# Altium schematic sheet Connectors.SchDoc: SmartCoin
size A4; Date: 22.06.2025; Author: Vamsi Krishna Sesham; Revision: A; SheetNumber: 3; SheetTotal: 5
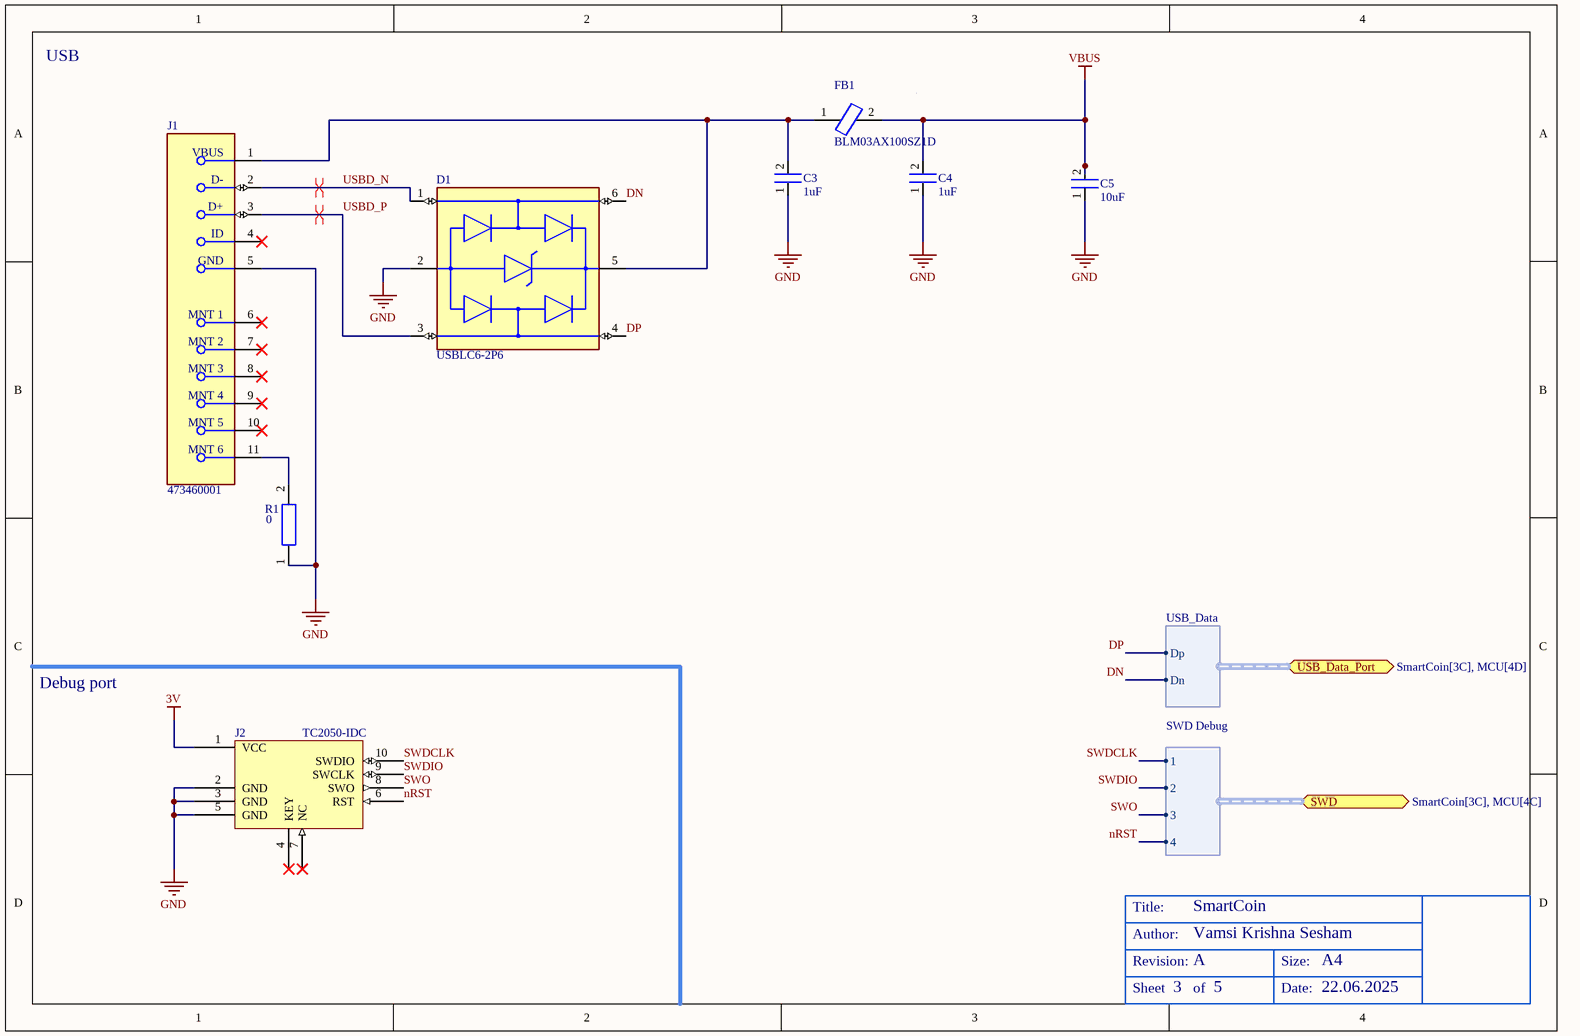
[diagram p0: Connectors.SchDoc]

## Parts
*  TitleBlock  (value not drawn)  (graphical)
C3  1uF  [Capacitor - 0201]
C4  1uF  [Capacitor - 0201]
C5  10uF  [Capacitor - 0402]
D1  USBLC6-2P6  [FP-SOT-666-MFG]
FB1  BLM03AX100SZ1D  [Ferrite Beat - 0201]
J1  473460001  [FP-473460001-MFG]
J2  TC2050-IDC  [TC2050-IDC]  (no BOM)
R1  0  [Resistor - 0402]

## Ports
SWD (bidir, harness SWD Debug, see SmartCoin[3C], MCU[4C]), USB_Data_Port (bidir, harness USB_Data, see SmartCoin[3C], MCU[4D])

## Harnesses
USB_Data: Dp, Dn
SWD Debug: 1, 2, 3, 4

## Nets
3V: J2.1(VCC)
GND: C3.1 C4.1 C5.1 D1.2(GND) J1.5(GND) J2.2(GND) J2.3(GND) J2.5(GND) R1.1
VBUS: C4.2 C5.2 FB1.2
DN: D1.6(I/O1) ; port USB_Data_Port.Dn
DP: D1.4(I/O2) ; port USB_Data_Port.Dp
nRST: J2.6(RST) ; port SWD.4
SWDCLK: J2.10(SWDIO) ; port SWD.1
SWDIO: J2.9(SWCLK) ; port SWD.2
SWO: J2.8(SWO) ; port SWD.3
USBD_N: D1.1(I/O1) J1.2(D-)
USBD_P: D1.3(I/O2) J1.3(D+)
NetC3_2: C3.2 D1.5(VBUS) FB1.1 J1.1(VBUS)
NetJ1_11: J1.11(MNT_6) R1.2

Not connected (* = marked no-connect by the designer): J1 4(ID)* 6(MNT_1)* 7(MNT_2)* 8(MNT_3)* 9(MNT_4)* 10(MNT_5)*; J2 4(KEY)* 7(NC)*

## Layout directives
differential pair: USBD_N, USBD_P

## Notes on the sheet
- USB
- Debug port
- (in symbol TitleBlock) Title:; Author:; Revision:; Size:; A4; Sheet; of; Date:

## Library data of the parts
C3 C4 = Capacitor - 0201
C5 = Capacitor - 0402
D1 = CMP-12225-000058-1: TVS DIODE 5.25V 17V SOT666; Min Breakdown Voltage: 6V; Power Line Protection: Yes; Element Configuration: Dual; Test Current: 1mA; Working Voltage: 5V; Number of Channels: 2; Max Reverse Leakage Current: 150nA; Direction: Unidirectional; Peak Pulse Current: 5A; Number of Elements: 1; Capacitance: 3.5pF; Max Breakdown Voltage: 6V; Height: 0.6mm; Depth: 1.3mm; Contact Plating: Tin; Reverse Breakdown Voltage: 6V; REACH SVHC: No SVHC; Operating Supply Voltage: 5V; Width: 1.3mm; Max Operating Temperature: 125°C; Reverse Standoff Voltage: 5V; ESD Protection: Yes; Package Quantity: 1; Termination: SMD/SMT; Length: 1.7mm; Leakage Current: 150nA; Number of Bidirectional Channels: 2; Case/Package: SOT-666; Min Operating Temperature: -40°C; Number of Pins: 6; Clamping Voltage: 17V; Breakdown Voltage: 6V; Lead Free: Lead Free; Radiation Hardening: No; Packaging: Tape and Reel; Mount: Surface Mount; Polarity: Unidirectional
FB1 = Ferrite Bead - 0201: Supplier 1: Digikey; Supplier Part Number 1: 445-MPZ1608S601ATD25CT-ND
J1 = CMP-2000-05246-2: CONN RCPT USB2.0 MICRO B SMD R/A; Manufacturer: Molex; Conn Orientation: Right Angle; Is Female: yes; Shielding: true; Pitch: 0.65mm; Number Of Contacts: 5; Voltage Rating: 30V; Current Rating: 1.8A; Device Class L2: USB Connectors; Digikey Description: CONN RCPT USB2.0 MICRO B SMD R/A; Height: 2.945mm; RoHS: TRUE; ComponentLink2Description: Datasheet; Octopart: https://octopart.com/47346-0001-molex-7164928; Automotive: No; Package: 0; Category: Conn; Device Class L1: Connectors; Usb Standard: USB 2.0; Temperature: -30°C to +85°C; Temperature Range Low: -30°C; Footprint Url: https://www.molex.com/pdm_docs/sd/473460001_sd.pdf; ComponentLink2URL: https://www.molex.com/webdocs/datasheets/pdf/en-us/0473460001_IO_CONNECTORS.pdf; Lead Free: Yes; Manufacturer Part Number: 473460001; Contact Material: Gold,Nickel; Temperature Range High: +85°C; Device Class L3: unset
R1 = Resistor - 0402